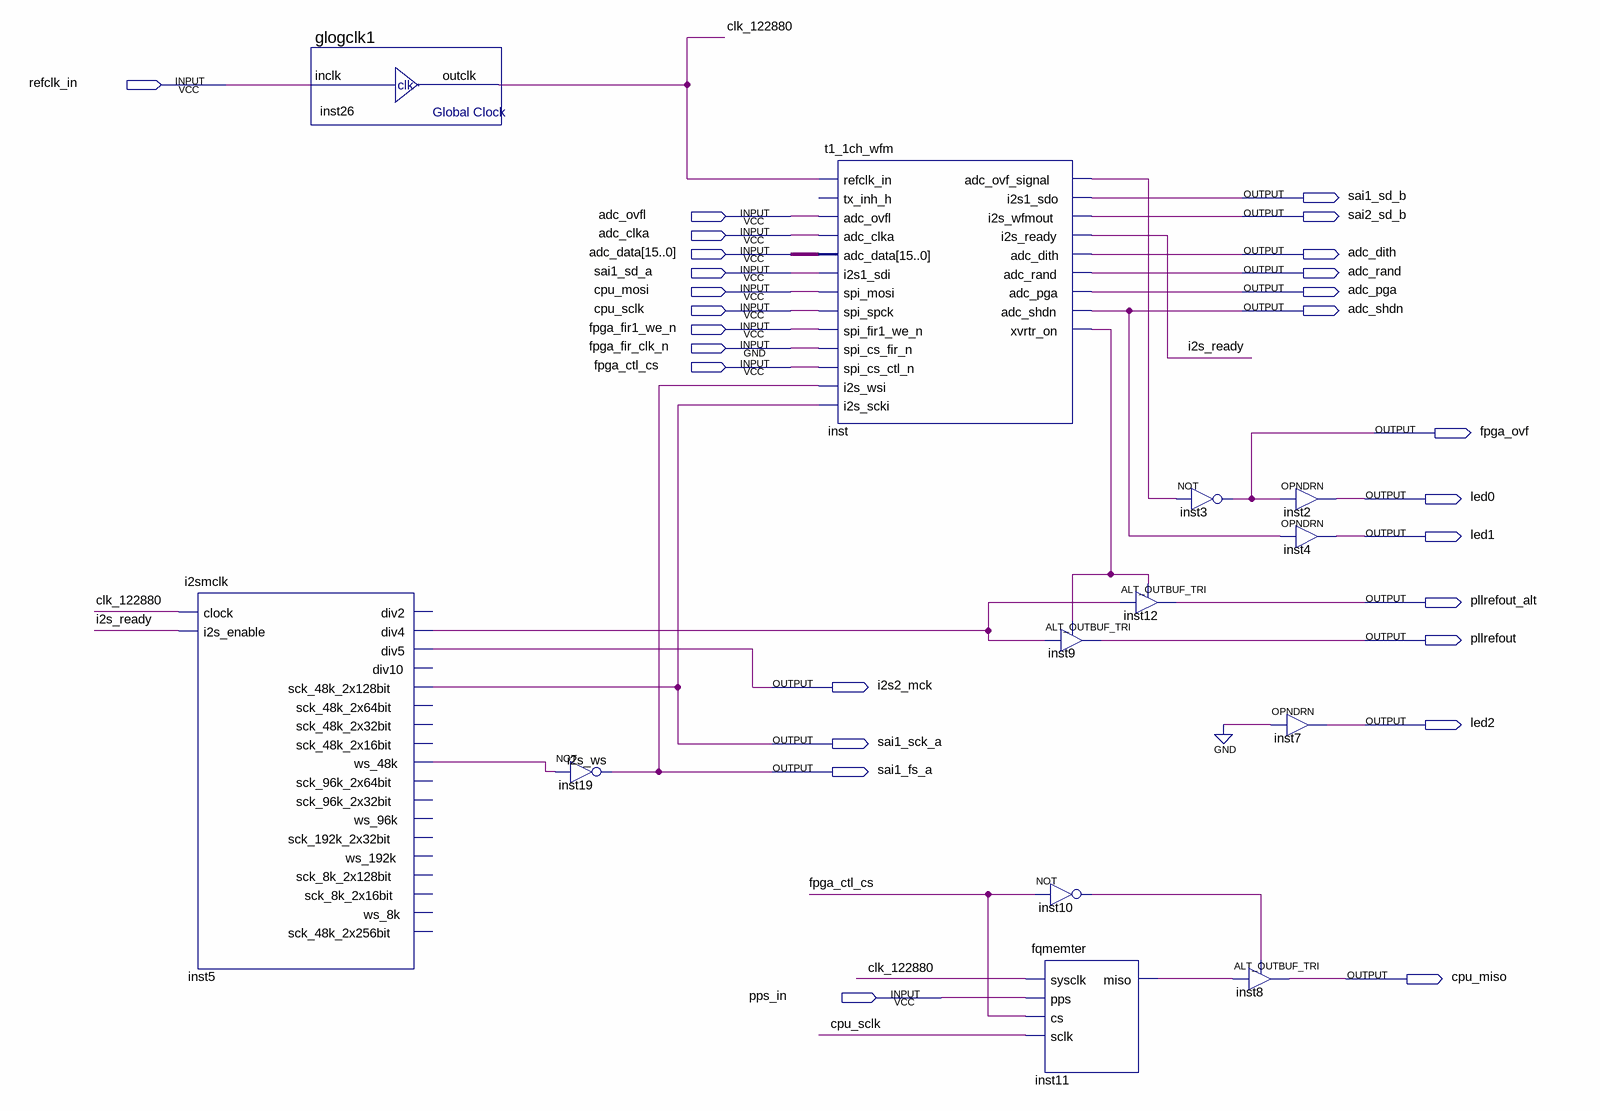
[diagram p0: schematic sheet]
// Quartus schematic tc1_top_v7_oleg4z.bdf as structural Verilog: 13 symbols, 27 pins
module tc1_top_v7_oleg4z (
  input  refclk_in,
  input  adc_ovfl,
  input  adc_clka,
  input  [15:0] adc_data,
  input  sai1_sd_a,
  input  cpu_mosi,
  input  cpu_sclk,
  input  fpga_fir1_we_n,
  input  fpga_fir_clk_n,
  input  fpga_ctl_cs,
  input  pps_in,
  output sai1_sd_b,
  output sai2_sd_b,
  output adc_dith,
  output adc_rand,
  output adc_pga,
  output adc_shdn,
  output fpga_ovf,
  output led0,
  output led1,
  output pllrefout_alt,
  output pllrefout,
  output i2s2_mck,
  output led2,
  output sai1_sck_a,
  output sai1_fs_a,
  output cpu_miso
);

  wire clk_122880, i2s_ready, inst5_div4, inst5_ws_48k, inst10_out, inst11_miso, inst_adc_ovf_signal,
       inst_xvrtr_on;

  i2smclk inst5 (
    .clock(clk_122880), .i2s_enable(i2s_ready), .div4(inst5_div4), .div5(i2s2_mck),
    .sck_48k_2x128bit(sai1_sck_a), .ws_48k(inst5_ws_48k));  // open: div2, div10, sck_48k_2x64bit, sck_48k_2x32bit, sck_48k_2x16bit, sck_96k_2x64bit, sck_96k_2x32bit, ws_96k, sck_192k_2x32bit, ws_192k, sck_8k_2x128bit, sck_8k_2x16bit, ws_8k, sck_48k_2x256bit
  glogclk1 inst26 (.inclk(refclk_in), .outclk(clk_122880));
  not inst19 (sai1_fs_a, inst5_ws_48k);
  t1_1ch_wfm inst (
    .refclk_in(clk_122880), .adc_ovfl(adc_ovfl), .adc_clka(adc_clka), .adc_data(adc_data),
    .i2s1_sdi(sai1_sd_a), .spi_mosi(cpu_mosi), .spi_spck(cpu_sclk), .spi_fir1_we_n(fpga_fir1_we_n),
    .spi_cs_fir_n(fpga_fir_clk_n), .spi_cs_ctl_n(fpga_ctl_cs), .i2s_wsi(sai1_fs_a), .i2s_scki(sai1_sck_a),
    .adc_ovf_signal(inst_adc_ovf_signal), .i2s1_sdo(sai1_sd_b), .i2s_wfmout(sai2_sd_b),
    .i2s_ready(i2s_ready), .adc_dith(adc_dith), .adc_rand(adc_rand), .adc_pga(adc_pga), .adc_shdn(adc_shdn),
    .xvrtr_on(inst_xvrtr_on));  // open: tx_inh_h
  ALT_OUTBUF_TRI inst9 (.i(inst5_div4), .oe(inst_xvrtr_on), .o(pllrefout));
  not inst10 (inst10_out, fpga_ctl_cs);
  fqmemter inst11 (.sysclk(clk_122880), .pps(pps_in), .cs(fpga_ctl_cs), .sclk(cpu_sclk), .miso(inst11_miso));
  ALT_OUTBUF_TRI inst12 (.i(inst5_div4), .oe(inst_xvrtr_on), .o(pllrefout_alt));
  not inst3 (fpga_ovf, inst_adc_ovf_signal);
  ALT_OUTBUF_TRI inst8 (.i(inst11_miso), .oe(inst10_out), .o(cpu_miso));
  OPNDRN inst2 (.IN(fpga_ovf), .OUT(led0));
  OPNDRN inst4 (.IN(adc_shdn), .OUT(led1));
  OPNDRN inst7 (.IN(1'b0), .OUT(led2));

  // Other names for the same wires on the sheet: i2s_ws = sai1_fs_a
endmodule
